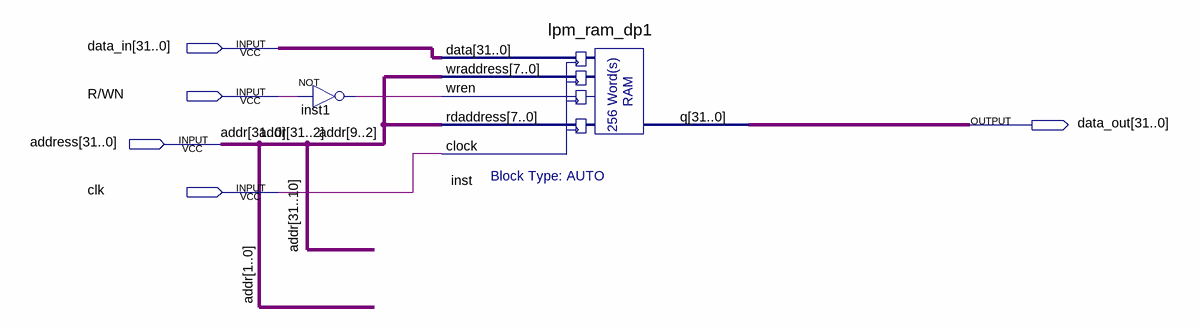
[diagram p0: schematic sheet]
// Quartus schematic Instruction_MEM.bdf as structural Verilog: 2 symbols, 5 pins
module Instruction_MEM (
  input  [31:0] data_in,
  input  \R/WN ,
  input  [31:0] address,
  input  clk,
  output [31:0] data_out
);

  wire inst1_out;

  not inst1 (inst1_out, \R/WN );
  lpm_ram_dp1 inst (
    .data(data_in), .wraddress(address[9:2]), .wren(inst1_out), .rdaddress(address[9:2]), .clock(clk),
    .q(data_out));

  // Other names for the same wires on the sheet: addr[31:0] = address
endmodule
